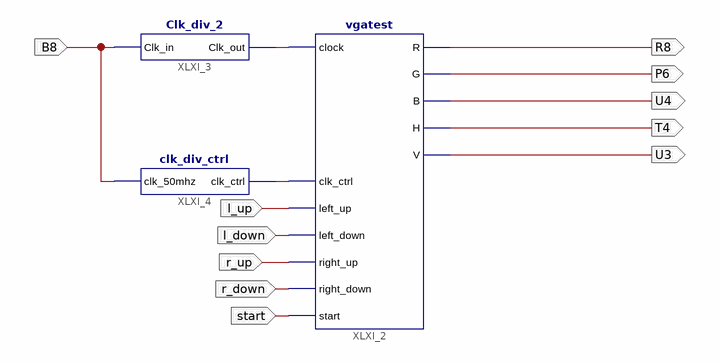
[diagram p0: schematic sheet 1]
// Xilinx ISE schematic Miniprojekt.sch (spartan3e) as structural Verilog: 3 symbols, 11 ports
module Miniprojekt (
  input  B8,
  input  l_up,
  input  l_down,
  input  r_up,
  input  r_down,
  input  start,
  output R8,
  output P6,
  output U4,
  output T4,
  output U3
);

  wire XLXN_1, XLXN_2;

  vgatest XLXI_2 (
    .clock(XLXN_1), .clk_ctrl(XLXN_2), .left_up(l_up), .left_down(l_down), .right_up(r_up),
    .right_down(r_down), .R(R8), .G(P6), .B(U4), .H(T4), .V(U3), .start(start));
  Clk_div_2 XLXI_3 (.Clk_in(B8), .Clk_out(XLXN_1));
  clk_div_ctrl XLXI_4 (.clk_50mhz(B8), .clk_ctrl(XLXN_2));
endmodule
